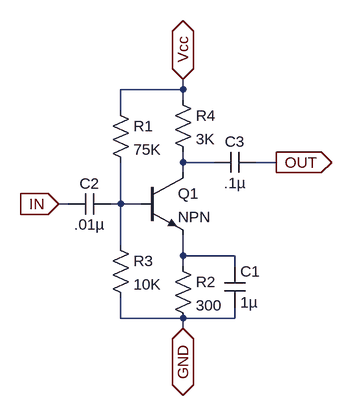
[diagram p0: schematic amp.asc]
amp.asc, the LTspice schematic file:
Version 4
SHEET 1 880 680
WIRE -144 208 -160 208
WIRE -64 64 -64 32
WIRE -64 208 -80 208
WIRE -64 208 -64 144
WIRE -64 272 -64 208
WIRE -64 384 -64 352
WIRE -32 208 -64 208
WIRE 32 32 -64 32
WIRE 32 32 32 16
WIRE 32 48 32 32
WIRE 32 144 32 128
WIRE 32 160 32 144
WIRE 32 288 32 256
WIRE 32 304 32 288
WIRE 32 384 -64 384
WIRE 32 400 32 384
WIRE 80 144 32 144
WIRE 112 288 32 288
WIRE 112 304 112 288
WIRE 112 384 32 384
WIRE 112 384 112 368
WIRE 176 144 144 144
FLAG -160 208 IN
IOPIN -160 208 In
FLAG 176 144 OUT
IOPIN 176 144 Out
FLAG 32 400 GND
IOPIN 32 400 BiDir
FLAG 32 16 Vcc
IOPIN 32 16 BiDir
SYMBOL npn -32 160 R0
SYMATTR InstName Q1
SYMBOL res -80 48 R0
SYMATTR InstName R1
SYMATTR Value 75K
SYMBOL cap 96 304 R0
SYMATTR InstName C1
SYMATTR Value 1µ
SYMBOL res 16 288 R0
SYMATTR InstName R2
SYMATTR Value 300
SYMBOL res -80 256 R0
SYMATTR InstName R3
SYMATTR Value 10K
SYMBOL cap -80 192 R90
WINDOW 0 0 32 VBottom 0
WINDOW 3 32 32 VTop 0
SYMATTR InstName C2
SYMATTR Value .01µ
SYMBOL cap 144 128 R90
WINDOW 0 0 32 VBottom 0
WINDOW 3 32 32 VTop 0
SYMATTR InstName C3
SYMATTR Value .1µ
SYMBOL res 16 32 R0
SYMATTR InstName R4
SYMATTR Value 3K

The netlist it stands for:
* amp.asc
Q1 N002 N001 N003 0 NPN
R1 Vcc N001 75K
C1 N003 GND 1µ
R2 N003 GND 300
R3 N001 GND 10K
C2 N001 IN .01µ
C3 OUT N002 .1µ
R4 Vcc N002 3K
.model NPN NPN
.model PNP PNP
.lib standard.bjt
.backanno
.end